# Altium project PROJ_B555.PrjPcb
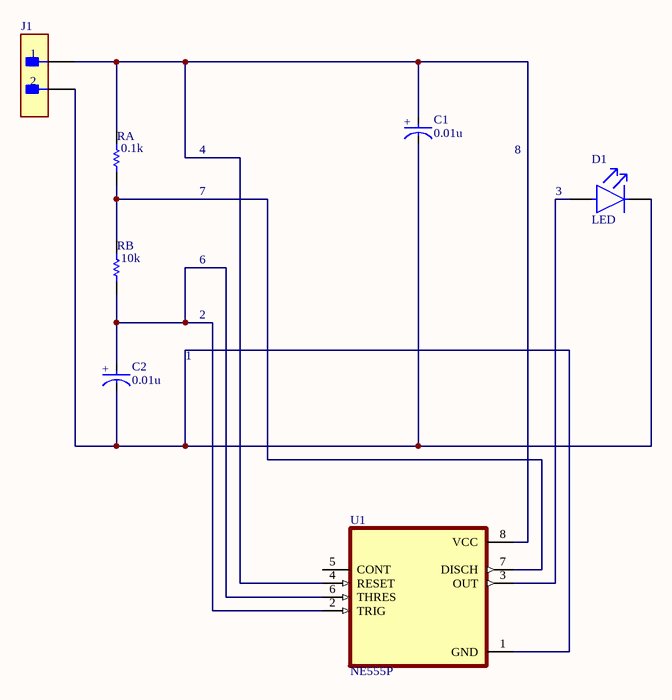
[diagram p0: SCHE_B555.SchDoc]
1 sheet, 7 parts. Net scope: global (net labels, ports and power ports of the same name join across sheets).
Board file: PCBB_B555.PcbDoc

## Sheet SCHE_B555.SchDoc
size A; DocumentNumber: 1; SheetNumber: 1; SheetTotal: 1

### Parts
C1  0.01u  [FP-RAD-TH-D_16_0_5-L_31_5-MFG]
C2  0.01u  [FP-RAD-TH-D_16_0_5-L_31_5-MFG]
D1  LED  [FP-HLMP-1301-MFG]
J1  (no value)  [FP-M20-9990246-MFG]
RA  0.1k  [RESA60-630X240]
RB  10k  [RESA60-630X240]
U1  NE555P  [DIP794W45P254L959H508Q8]

### Nets
NetC1_1: C1.1(C) C2.1(C) D1.1(C) J1.2 U1.1(GND)
NetC1_2: C1.2(A) J1.1 RA.1 U1.4(RESET) U1.8(VCC)
NetC2_2: C2.2(A) RB.2 U1.2(TRIG) U1.6(THRES)
NetD1_2: D1.2(A) U1.3(OUT)
NetRA_2: RA.2 RB.1 U1.7(DISCH)

Not connected (* = marked no-connect by the designer): U1 5(CONT)

### Notes on the sheet
- 4
- 7
- 8
- (near D1) 3
- 6
- 2
- 1
- (in symbol CMP-05427-001651-1) +

### Library data of the parts
C1 C2 = CMP-05427-001651-1: Leakage Current: 3uA; Ripple Current (AC): 1.47A; Capacitance: 2.2mF; Tolerance: 20%; Voltage Rating: 50V; Lead Diameter: 0.8mm; Lead/Base Style: Straight; Dissipation Factor: 0.14%; Life (Hours): 2000Hour; Mount: Through Hole; RoHS Compliant: Yes; Lead Pitch: 7.5mm; Package Quantity: 100; REACH SVHC: No SVHC; Height: 31.5mm; Case/Package: Radial; Contact Plating: Tin; Radiation Hardening: No; Termination: Radial; Construction: RADIAL; Diameter: 16mm; Series: NHG; Max Operating Temperature: 105°C; Length: 31.5mm; Height - Seated (Max): 1.319inch; Width: 16mm; Voltage Rating (DC): 50V; Min Operating Temperature: -55°C; Voltage: 50V; Packaging: Bulk; Number of Pins: 2; Ripple Current: 1.47A
D1 = CMP-18399-000007-1: Manufacturer: Broadcom; Forward Current: 10mA; Max Junction Temp: +110°C; Wavelength: 626nm; Colour: Red; Led Orientation: Straight; Viewing Angle: 60°; Luminous Intensity: 3.4mcd; Forward Voltage: 1.9V; Reverse Voltage: 5V; Peak Emmision Wavelength: 635nm; Mouser Description: Standard LEDs - Through Hole Red Diffused 635nm 3.4mcd; RoHS: TRUE; ComponentLink2Description: Datasheet; Device Class L1: Optoelectronics; Temperature Range High: +100°C; Manufacturer Part Number: HLMP-1301; ComponentLink2URL: https://docs.broadcom.com/docs/AV02-1555EN; Digikey Description: LED RED DIFFUSED T-1 T/H; Automotive: No; Device Class L2: LEDs; Temperature Range Low: -40°C; Octopart: https://octopart.com/hlmp-1301-broadcom-71130345; Category: Diode; Lead Free: Yes; Device Class L3: unset; Package: 0; Temperature: -40°C to +100°C
J1 = CMP-15831-000009-1: {1 to V_CC , 2 to GND}; Manufacturer: Harwin; Manufacturer Part Number: M20-9990246; Conn Gender: Male; Conn Orientation: Vertical; Pitch: 2.54mm; Number Of Contacts: 2; Current Rating: 3A; ComponentLink2URL: https://cdn.harwin.com/pdfs/M20-999.pdf; ComponentLink2Description: Datasheet; Package: M20-9990246; Temperature: -40°C to +105°C; Octopart: https://octopart.com/m20-9990246-harwin-2590635; Mouser Description: 2.54mm (0.1") Pitch SIL Vertical PC Tail Pin Header, 6.1mm mating pin height, tin, 2 contacts; Temperature Range High: +105°C; Device Class L1: Connectors; RoHS: TRUE; Automotive: No; Height: 8.99mm; Number Of Rows: 1; Contact Material: Tin,Nickel; Category: Conn; Lead Free: Yes; Digikey Description: CONN HEADER VERT 2POS 2.54MM; Temperature Range Low: -40°C; Device Class L3: unset; Device Class L2: Headers and Wire Housings
RA RB = CMP-1659-00063-1: Tolerance: 20%; Shielding: Shielded; Current Rating: 1.3 A; Case\Package: 1008; ComponentLink1Description: Manufacturer URL; Packaging: Tape and Reel; ComponentLink2Description: Datasheet; Radiation Hardening: No; ComponentLink2URL: http://www.yageo.com/documents/recent/Yageo%20LR_MFR_2013.pdf; Min Operating Temperature: -55 degC; Mount: Surface Mount; Width: 2 mm; Length: 2.5 mm; Max Operating Temperature: 125 degC; PackageReference: MFR-25; Height: 1.2 mm; ComponentLink1URL: http://www.yageo.com/; DatasheetVersion: Apr-13; RoHSCompliant: true; Package Quantity: 3000; Case Code (Metric): 2520; PackageDescription: 2-Pin Axial Lead, Dia 2.4 mm, Body Length 6.3 mm
U1 = NE555P: Price: None; Package: None; Availability: Unavailable; MP: NE555P; Value: *